# Altium project DTB217-AW1.PrjPcb
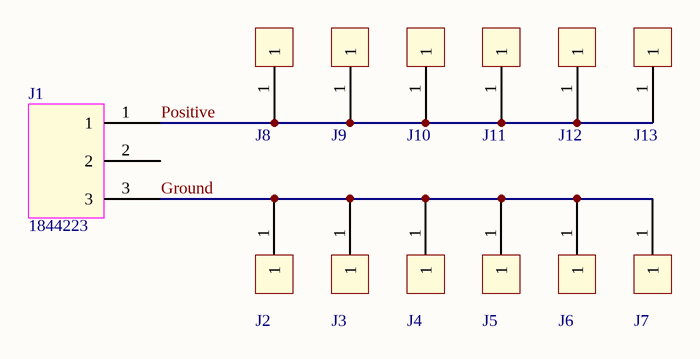
[diagram p0: DTB217-AW1.SchDoc]
1 sheet, 13 parts. Net scope: global (net labels, ports and power ports of the same name join across sheets).
Board file: DTB217-AW1.PcbDoc

## Sheet DTB217-AW1.SchDoc
size A; SheetNumber: 1; SheetTotal: 1

### Parts
J1  1844223  [1844223]
J2  CONN HEADER VERT 1POS  [TSW-101-17-G-S]  (value not drawn)
J3  CONN HEADER VERT 1POS  [TSW-101-17-G-S]  (value not drawn)
J4  CONN HEADER VERT 1POS  [TSW-101-17-G-S]  (value not drawn)
J5  CONN HEADER VERT 1POS  [TSW-101-17-G-S]  (value not drawn)
J6  CONN HEADER VERT 1POS  [TSW-101-17-G-S]  (value not drawn)
J7  CONN HEADER VERT 1POS  [TSW-101-17-G-S]  (value not drawn)
J8  CONN HEADER VERT 1POS  [TSW-101-17-G-S]  (value not drawn)
J9  CONN HEADER VERT 1POS  [TSW-101-17-G-S]  (value not drawn)
J10  CONN HEADER VERT 1POS  [TSW-101-17-G-S]  (value not drawn)
J11  CONN HEADER VERT 1POS  [TSW-101-17-G-S]  (value not drawn)
J12  CONN HEADER VERT 1POS  [TSW-101-17-G-S]  (value not drawn)
J13  CONN HEADER VERT 1POS  [TSW-101-17-G-S]  (value not drawn)

### Nets
Ground: J1.3 J2.1 J3.1 J4.1 J5.1 J6.1 J7.1
Positive: J1.1 J8.1 J9.1 J10.1 J11.1 J12.1 J13.1

Not connected (* = marked no-connect by the designer): J1 2

### Library data of the parts
J1 = 1844223: 3 Position Terminal Block Header, Male Pins, Shrouded (4 Side) 0.138" (3.50mm) 90°, Right Angle Through Hole; Manufacturer: Phoenix Contact; Vendor: Digikey; Vendor PN: 277-2415-ND; VoltServer PN: CON-00009; Manufacturer PN: 1844223
J2-J13 = TSW-101-17-G-S: Connector Header Through Hole 1 position; Manufacturer: Samtec Inc; Value: 1 position connector header; Vendor: Digi-Key; Vendor PN: SAM1061-01-ND; Manufacturer PN: TSW-101-17-G-S